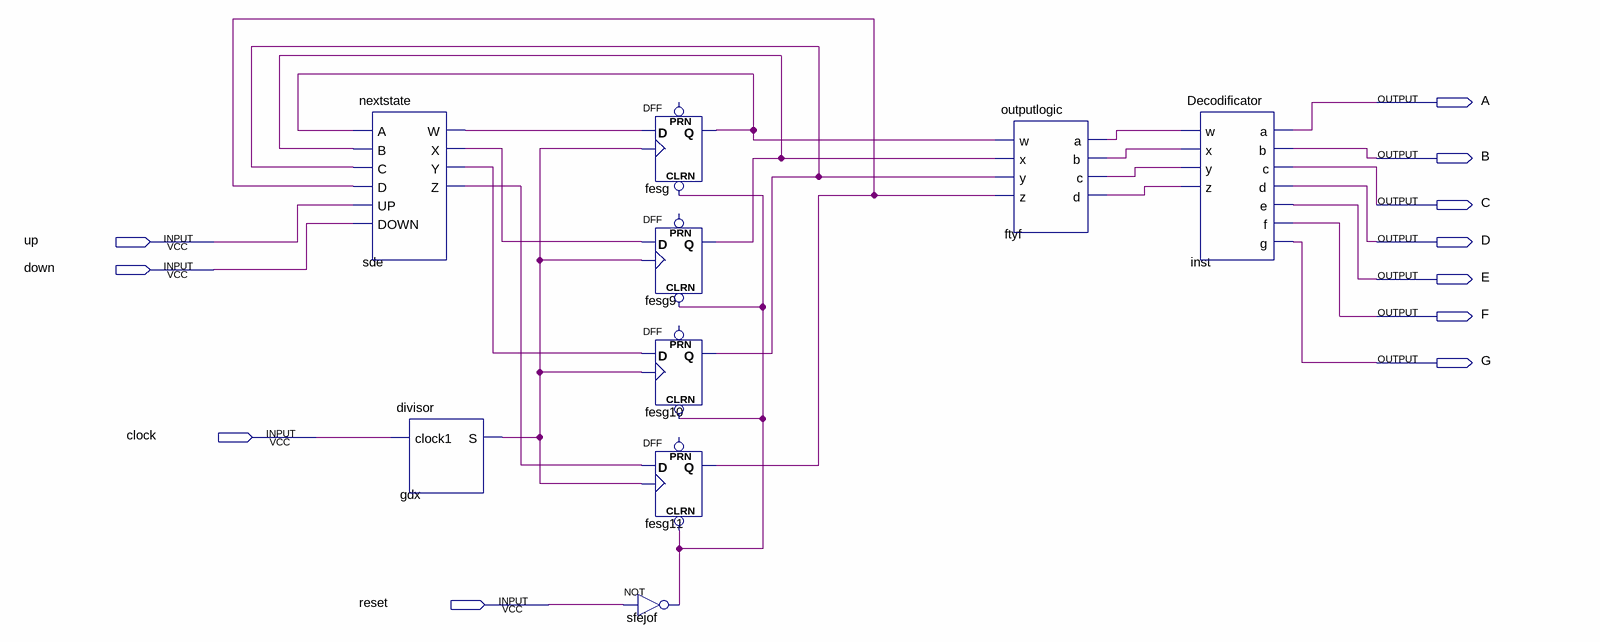
[diagram p0: schematic sheet]
// Quartus schematic statemachine.bdf as structural Verilog: 9 symbols, 11 pins
module statemachine (
  input  up,
  input  down,
  input  clock,
  input  reset,
  output A,
  output B,
  output C,
  output D,
  output E,
  output F,
  output G
);

  wire fesg9_q, fesg10_q, fesg11_q, fesg_q, ftyf_a, ftyf_b, ftyf_c, ftyf_d, gdx_s, sde_w, sde_x, sde_y,
       sde_z, sfejof_out;

  nextstate sde (
    .A(fesg_q), .B(fesg9_q), .C(fesg10_q), .D(fesg11_q), .UP(up), .DOWN(down), .W(sde_w), .X(sde_x),
    .Y(sde_y), .Z(sde_z));
  divisor gdx (.clock1(clock), .S(gdx_s));
  not sfejof (sfejof_out, reset);
  DFF fesg (.CLRN(sfejof_out), .CLK(gdx_s), .D(sde_w), .Q(fesg_q));  // open: PRN
  DFF fesg9 (.CLRN(sfejof_out), .CLK(gdx_s), .D(sde_x), .Q(fesg9_q));  // open: PRN
  DFF fesg10 (.CLRN(sfejof_out), .CLK(gdx_s), .D(sde_y), .Q(fesg10_q));  // open: PRN
  DFF fesg11 (.CLRN(sfejof_out), .CLK(gdx_s), .D(sde_z), .Q(fesg11_q));  // open: PRN
  outputlogic ftyf (
    .w(fesg_q), .x(fesg9_q), .y(fesg10_q), .z(fesg11_q), .a(ftyf_a), .b(ftyf_b), .c(ftyf_c), .d(ftyf_d));
  Decodificator inst (.w(ftyf_a), .x(ftyf_b), .y(ftyf_c), .z(ftyf_d), .a(A), .b(B), .c(C), .d(D), .e(E), .f(F), .g(G));
endmodule
